# EAGLE design ProtoBricks_8x8 (EAGLE 9.6.2)
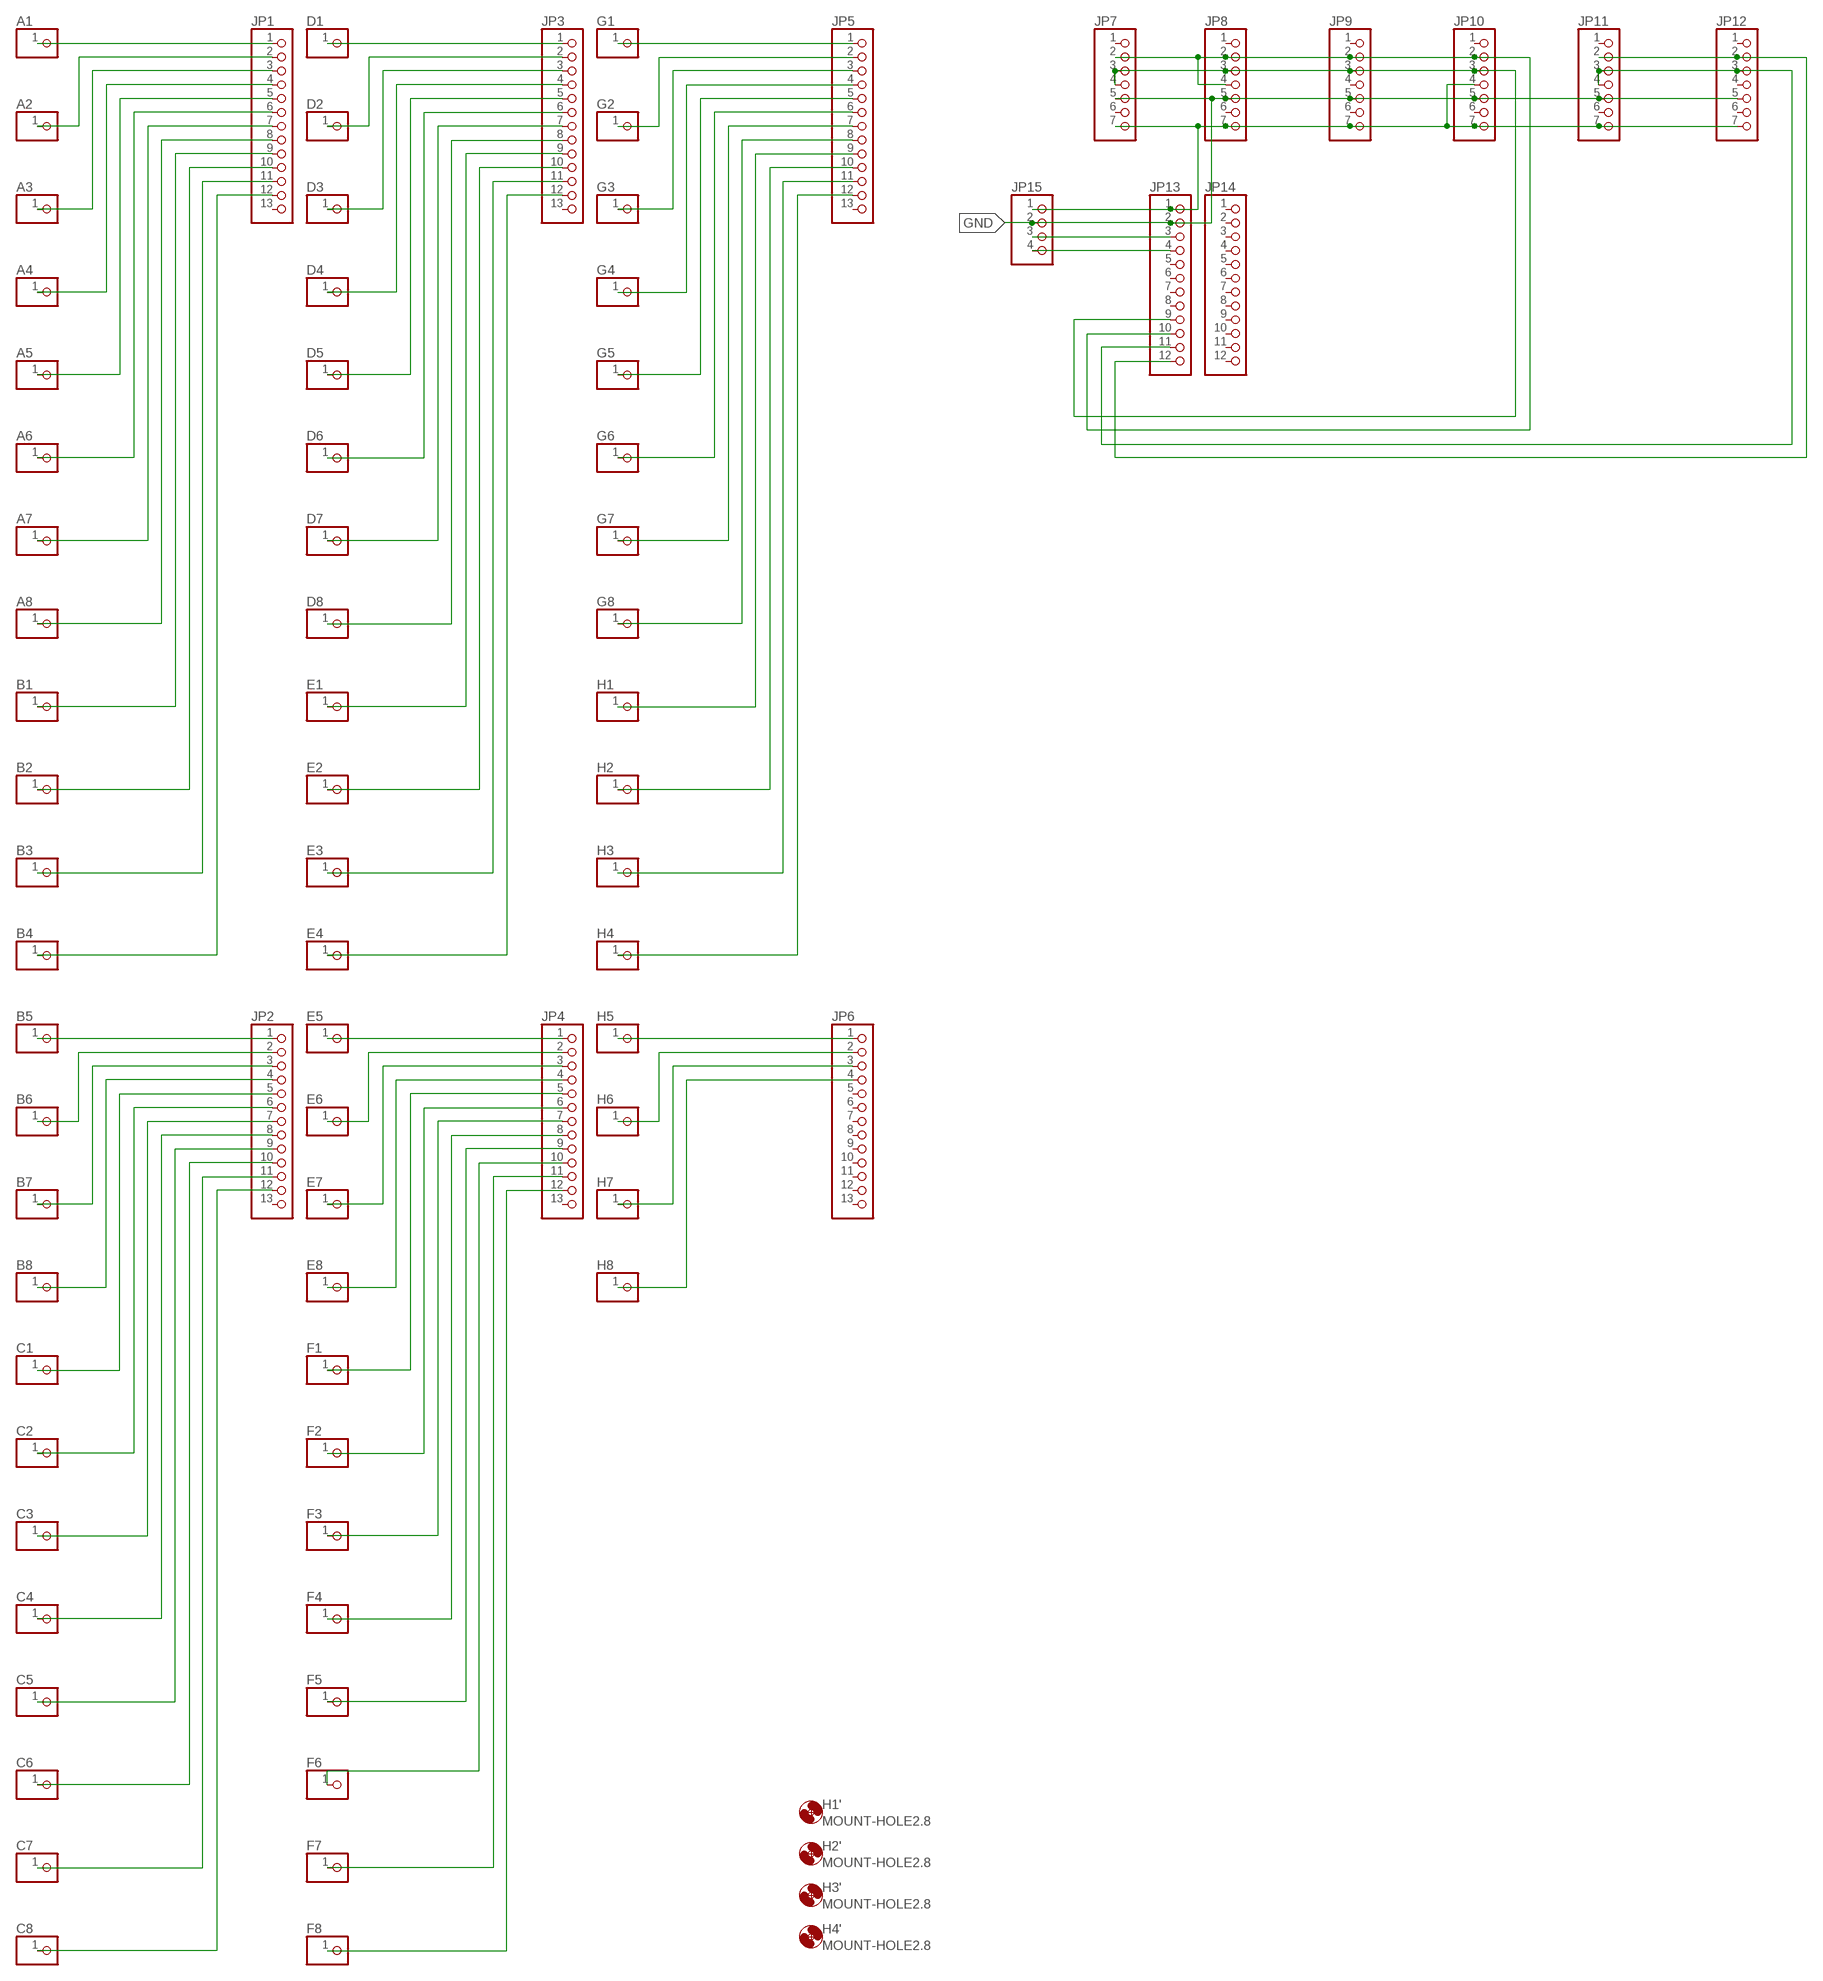
[diagram p0: schematic, sheet 1]

## Parts
A1  PINHD-1X1  [1X01]
A2  PINHD-1X1  [1X01]
A3  PINHD-1X1  [1X01]
A4  PINHD-1X1  [1X01]
A5  PINHD-1X1  [1X01]
A6  PINHD-1X1  [1X01]
A7  PINHD-1X1  [1X01]
A8  PINHD-1X1  [1X01]
B1  PINHD-1X1  [1X01]
B2  PINHD-1X1  [1X01]
B3  PINHD-1X1  [1X01]
B4  PINHD-1X1  [1X01]
B5  PINHD-1X1  [1X01]
B6  PINHD-1X1  [1X01]
B7  PINHD-1X1  [1X01]
B8  PINHD-1X1  [1X01]
C1  PINHD-1X1  [1X01]
C2  PINHD-1X1  [1X01]
C3  PINHD-1X1  [1X01]
C4  PINHD-1X1  [1X01]
C5  PINHD-1X1  [1X01]
C6  PINHD-1X1  [1X01]
C7  PINHD-1X1  [1X01]
C8  PINHD-1X1  [1X01]
D1  PINHD-1X1  [1X01]
D2  PINHD-1X1  [1X01]
D3  PINHD-1X1  [1X01]
D4  PINHD-1X1  [1X01]
D5  PINHD-1X1  [1X01]
D6  PINHD-1X1  [1X01]
D7  PINHD-1X1  [1X01]
D8  PINHD-1X1  [1X01]
E1  PINHD-1X1  [1X01]
E2  PINHD-1X1  [1X01]
E3  PINHD-1X1  [1X01]
E4  PINHD-1X1  [1X01]
E5  PINHD-1X1  [1X01]
E6  PINHD-1X1  [1X01]
E7  PINHD-1X1  [1X01]
E8  PINHD-1X1  [1X01]
F1  PINHD-1X1  [1X01]
F2  PINHD-1X1  [1X01]
F3  PINHD-1X1  [1X01]
F4  PINHD-1X1  [1X01]
F5  PINHD-1X1  [1X01]
F6  PINHD-1X1  [1X01]
F7  PINHD-1X1  [1X01]
F8  PINHD-1X1  [1X01]
G1  PINHD-1X1  [1X01]
G2  PINHD-1X1  [1X01]
G3  PINHD-1X1  [1X01]
G4  PINHD-1X1  [1X01]
G5  PINHD-1X1  [1X01]
G6  PINHD-1X1  [1X01]
G7  PINHD-1X1  [1X01]
G8  PINHD-1X1  [1X01]
H1  PINHD-1X1  [1X01]
H1'  MOUNT-HOLE2.8  [2,8]
H2  PINHD-1X1  [1X01]
H2'  MOUNT-HOLE2.8  [2,8]
H3  PINHD-1X1  [1X01]
H3'  MOUNT-HOLE2.8  [2,8]
H4  PINHD-1X1  [1X01]
H4'  MOUNT-HOLE2.8  [2,8]
H5  PINHD-1X1  [1X01]
H6  PINHD-1X1  [1X01]
H7  PINHD-1X1  [1X01]
H8  PINHD-1X1  [1X01]
JP1  PINHD-1X13  [1X13]
JP2  PINHD-1X13  [1X13]
JP3  PINHD-1X13  [1X13]
JP4  PINHD-1X13  [1X13]
JP5  PINHD-1X13  [1X13]
JP6  PINHD-1X13  [1X13]
JP7  PINHD-1X7  [1X07]
JP8  PINHD-1X7  [1X07]
JP9  PINHD-1X7  [1X07]
JP10  PINHD-1X7  [1X07]
JP11  PINHD-1X7  [1X07]
JP12  PINHD-1X7  [1X07]
JP13  PINHD-1X12  [1X12]
JP14  PINHD-1X12  [1X12]
JP15  PINHD-1X4  [1X04]

## Nets
GND: JP7.5 JP8.5 JP9.5 JP10.5 JP11.5 JP12.5 JP13.2 JP15.2
N$1: A1.1 JP1.1
N$2: A2.1 JP1.2
N$3: B5.1 JP2.1
N$4: A3.1 JP1.3
N$5: A4.1 JP1.4
N$6: A5.1 JP1.5
N$7: A6.1 JP1.6
N$8: A7.1 JP1.7
N$9: A8.1 JP1.8
N$10: B1.1 JP1.9
N$11: C8.1 JP2.12
N$12: C7.1 JP2.11
N$13: C6.1 JP2.10
N$14: C5.1 JP2.9
N$15: C4.1 JP2.8
N$16: B2.1 JP1.10
N$17: C3.1 JP2.7
N$18: C2.1 JP2.6
N$19: C1.1 JP2.5
N$20: B8.1 JP2.4
N$21: D1.1 JP3.1
N$22: B7.1 JP2.3
N$23: B6.1 JP2.2
N$24: D2.1 JP3.2
N$25: B3.1 JP1.11
N$26: D3.1 JP3.3
N$27: D4.1 JP3.4
N$28: D5.1 JP3.5
N$29: D6.1 JP3.6
N$30: D7.1 JP3.7
N$31: D8.1 JP3.8
N$32: B4.1 JP1.12
N$33: E1.1 JP3.9
N$34: E2.1 JP3.10
N$35: E3.1 JP3.11
N$36: E4.1 JP3.12
N$37: E5.1 JP4.1
N$38: E6.1 JP4.2
N$39: E7.1 JP4.3
N$40: E8.1 JP4.4
N$41: G1.1 JP5.1
N$42: G2.1 JP5.2
N$43: G3.1 JP5.3
N$44: G4.1 JP5.4
N$45: G5.1 JP5.5
N$46: G6.1 JP5.6
N$47: G7.1 JP5.7
N$48: G8.1 JP5.8
N$49: H1.1 JP5.9
N$50: H2.1 JP5.10
N$51: H3.1 JP5.11
N$52: H4.1 JP5.12
N$53: H5.1 JP6.1
N$54: H6.1 JP6.2
N$55: H7.1 JP6.3
N$56: H8.1 JP6.4
N$57: F1.1 JP4.5
N$58: F2.1 JP4.6
N$59: F3.1 JP4.7
N$60: F4.1 JP4.8
N$61: F5.1 JP4.9
N$62: F6.1 JP4.10
N$63: F7.1 JP4.11
N$64: F8.1 JP4.12
N$67: JP7.2 JP8.2 JP8.4 JP9.2 JP10.2 JP13.10
N$68: JP7.3 JP7.4 JP8.3 JP9.3 JP10.3 JP13.9
N$69: JP11.2 JP12.2 JP13.12
N$70: JP11.3 JP11.4 JP12.3 JP13.11
N$71: JP7.7 JP8.7 JP9.7 JP10.4 JP10.7 JP11.7 JP12.7 JP13.1 JP15.1
N$73: JP13.3 JP15.3
N$74: JP13.4 JP15.4
Unconnected: JP1.13 JP2.13 JP3.13 JP4.13 JP5.13 JP6.5 JP6.6 JP6.7 JP6.8 JP6.9 JP6.10 JP6.11 JP6.12 JP6.13 JP7.1 JP7.6 JP8.1 JP8.6 JP9.1 JP9.4 JP9.6 JP10.1 JP10.6 JP11.1 JP11.6 JP12.1 JP12.4 JP12.6 JP13.5 JP13.6 JP13.7 JP13.8 JP14.1 JP14.2 JP14.3 JP14.4 JP14.5 JP14.6 JP14.7 JP14.8 JP14.9 JP14.10 JP14.11 JP14.12

## Library data of the parts
A1-A8 B1-B8 C1-C8 D1-D8 E1-E8 F1-F8 G1-G8 H1-H8 = pinhead:PINHD-1X1: PIN HEADER
H1' H2' H3' H4' = holes:MOUNT-HOLE: MOUNTING HOLE with drill center marker
JP1-JP6 = pinhead:PINHD-1X13: PIN HEADER
JP7-JP12 = pinhead:PINHD-1X7: PIN HEADER
JP13 JP14 = pinhead:PINHD-1X12: PIN HEADER
JP15 = pinhead:PINHD-1X4: PIN HEADER

## Board
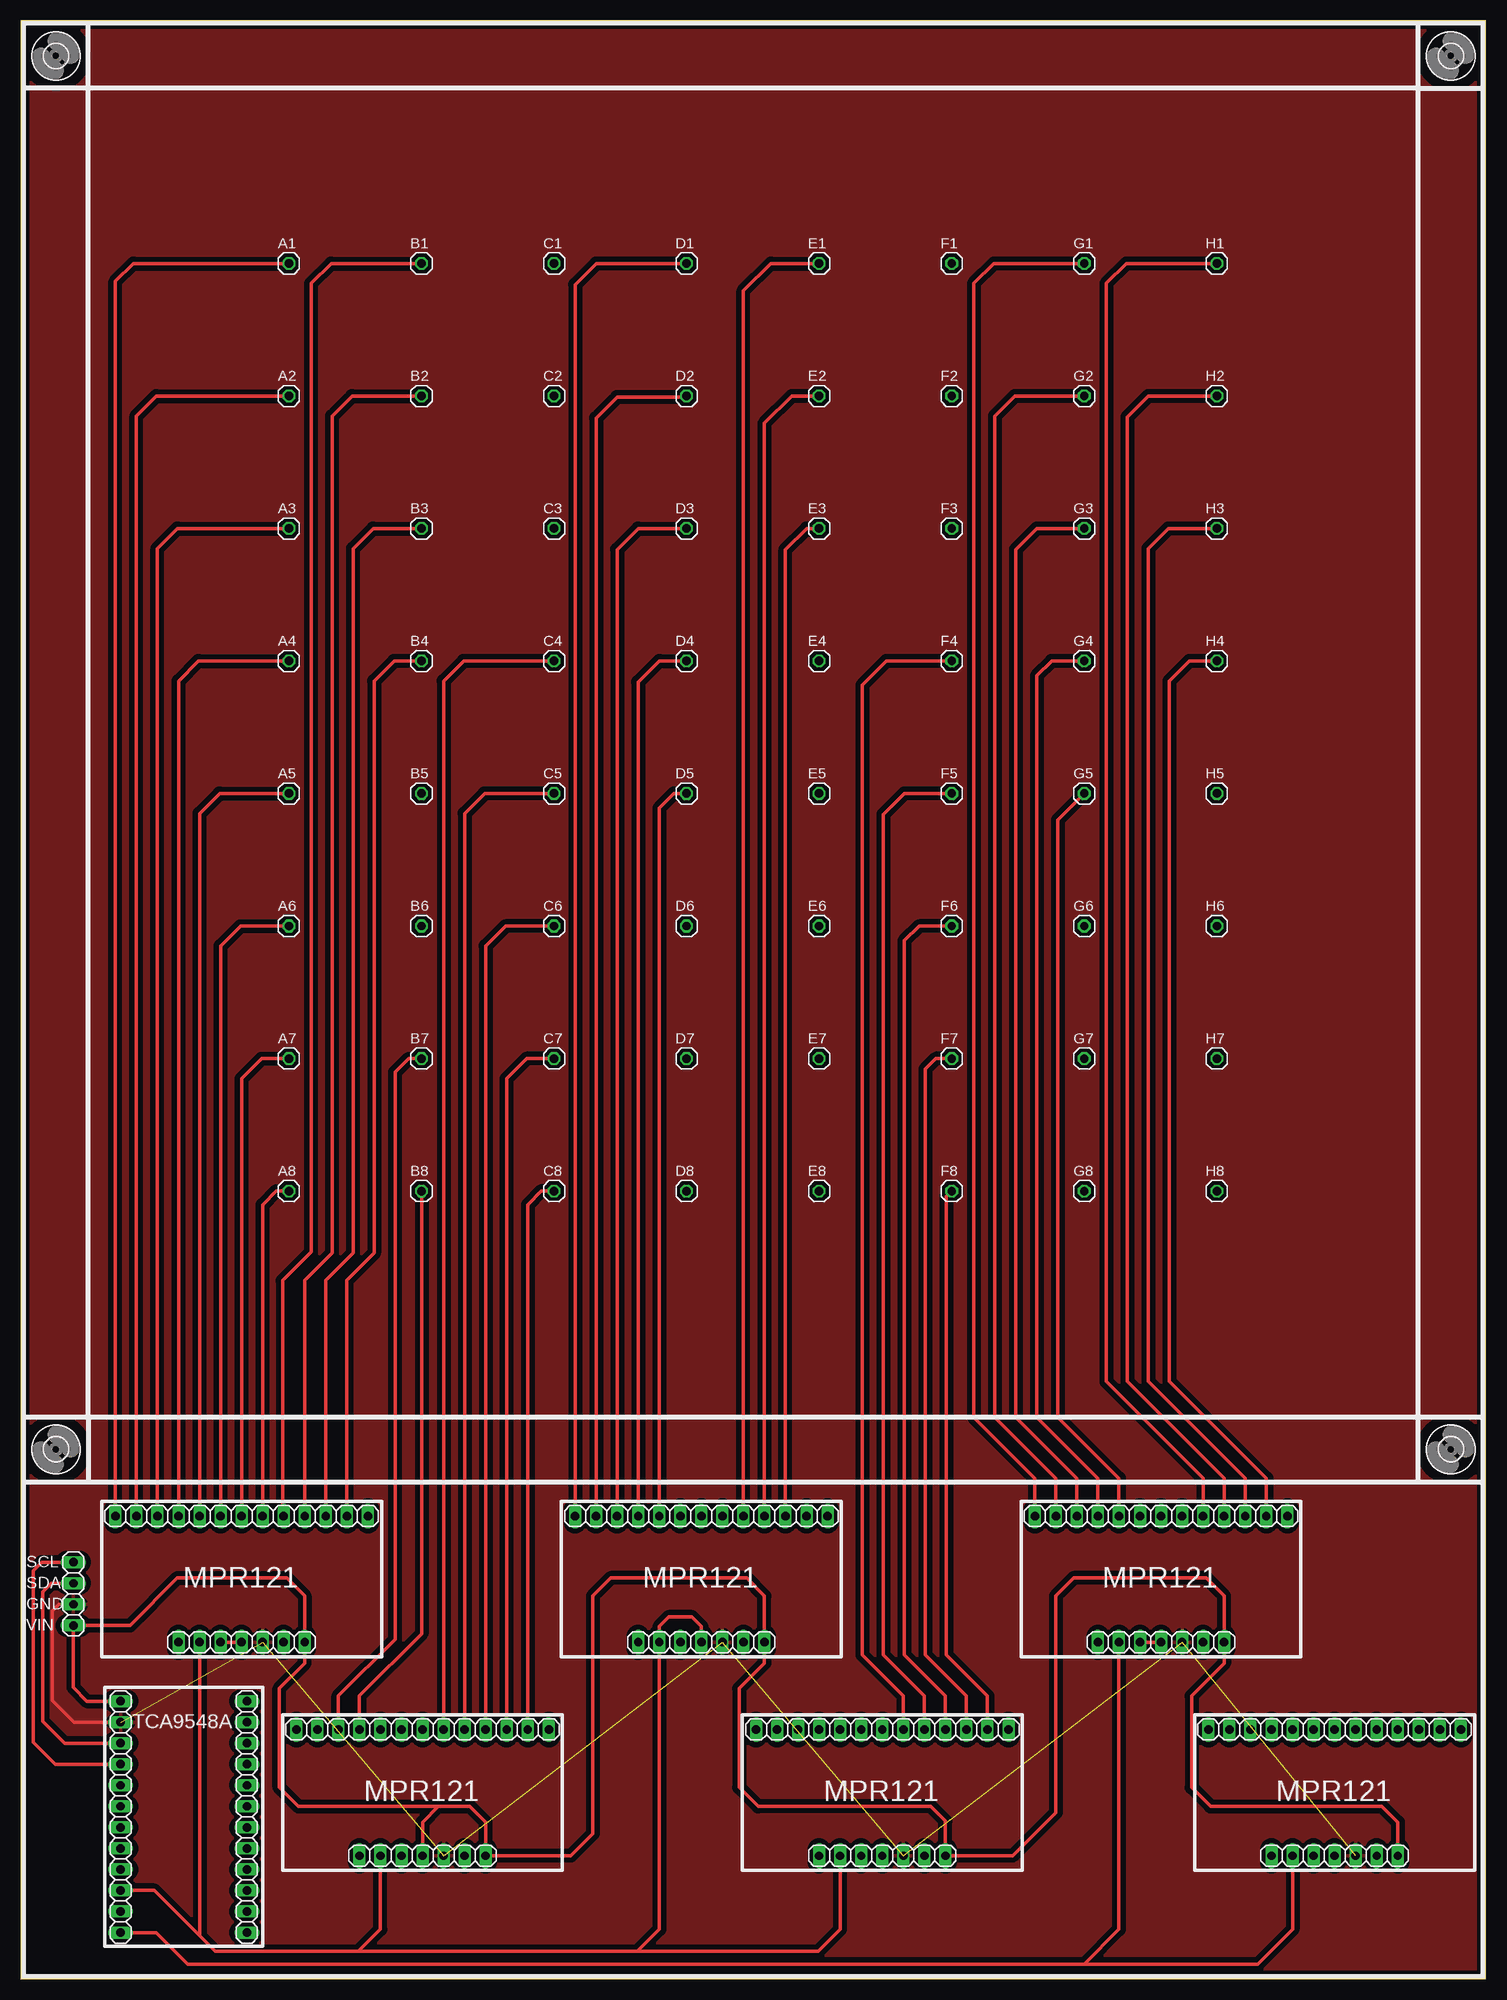
[diagram p1: board, top side]
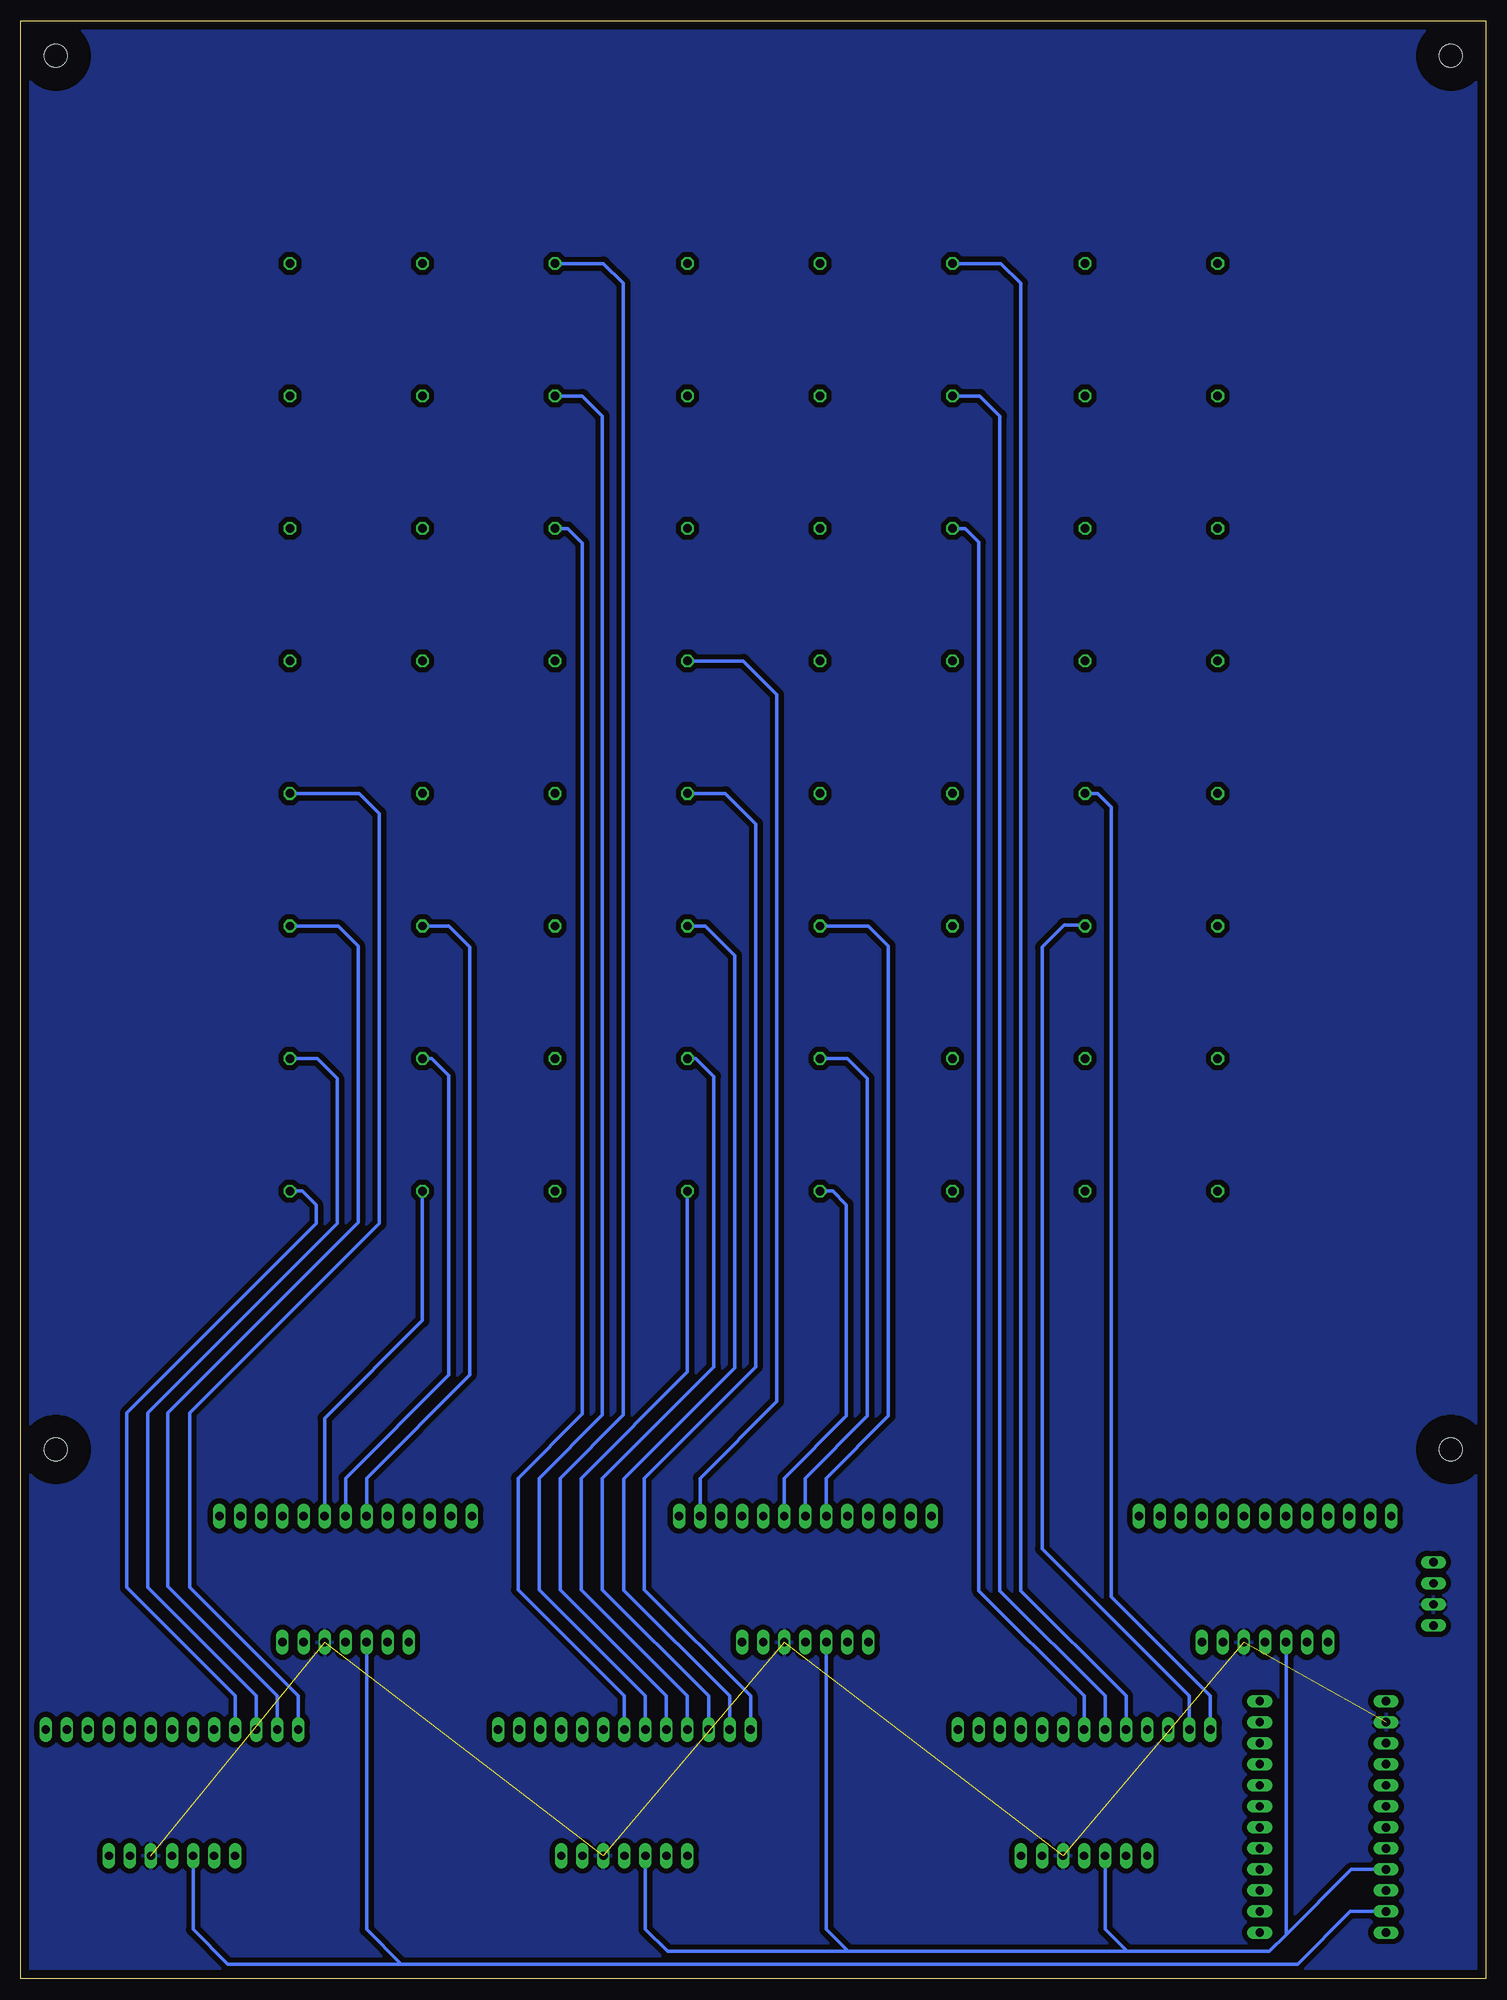
[diagram p2: board, bottom side, seen from below]

Size 176.89 x 236.45 mm. Coordinates in mm from the lower left corner, seen from the top.
Outline: 0,0 176.89,0 176.89,236.45 0,236.45 0,0
Copper layers (1*16): Top 0.035mm / dielectric 1.5mm / Bottom 0.035mm
Design rules "default": minimum track width 6mil, minimum drill 0.35mm, track to track 6mil, track to pad 6mil, pad to pad 6mil, via to via 6mil, smd to smd 6mil, copper to edge 40mil, drill to drill 6mil, minimum pad ring 10mil, minimum via ring 8mil, stop-mask expansion 4mil, vias tented up to drill 0mil, thermal gap 10mil

### Footprints (pad centres in the part's own frame; a part is rotated, then mirrored left to right if it is on the bottom)
1X01 = drill 1.016 octagon: 1 0,0
2,8 = hole 2.8: 0,0
1X13 = drill 1.016 long: 1 -15.24,0; 2 -12.7,0; 3 -10.16,0; 4 -7.62,0; 5 -5.08,0; 6 -2.54,0; 7 0,0; 8 2.54,0; 9 5.08,0; 10 7.62,0; 11 10.16,0; 12 12.7,0; 13 15.24,0
1X07 = drill 1.016 long: 1 -7.62,0; 2 -5.08,0; 3 -2.54,0; 4 0,0; 5 2.54,0; 6 5.08,0; 7 7.62,0
1X12 = drill 1.016 long: 1 -13.97,0; 2 -11.43,0; 3 -8.89,0; 4 -6.35,0; 5 -3.81,0; 6 -1.27,0; 7 1.27,0; 8 3.81,0; 9 6.35,0; 10 8.89,0; 11 11.43,0; 12 13.97,0
1X04 = drill 1.016 long: 1 -3.81,0; 2 -1.27,0; 3 1.27,0; 4 3.81,0

### Placement (x,y rotation side)
A1  32.38,207.14 0 top
A2  32.38,191.13 0 top
A3  32.38,175.13 0 top
A4  32.38,159.13 0 top
A5  32.38,143.13 0 top
A6  32.38,127.13 0 top
A7  32.38,111.12 0 top
A8  32.38,95.12 0 top
B1  48.39,207.14 0 top
B2  48.39,191.13 0 top
B3  48.39,175.13 0 top
B4  48.39,159.13 0 top
B5  48.39,143.13 0 top
B6  48.39,127.13 0 top
B7  48.39,111.12 0 top
B8  48.39,95.12 0 top
C1  64.39,207.14 0 top
C2  64.39,191.13 0 top
C3  64.39,175.13 0 top
C4  64.39,159.13 0 top
C5  64.39,143.13 0 top
C6  64.39,127.13 0 top
C7  64.39,111.12 0 top
C8  64.39,95.12 0 top
D1  80.39,207.14 0 top
D2  80.39,191.13 0 top
D3  80.39,175.13 0 top
D4  80.39,159.13 0 top
D5  80.39,143.13 0 top
D6  80.39,127.13 0 top
D7  80.39,111.12 0 top
D8  80.39,95.12 0 top
E1  96.39,207.14 0 top
E2  96.39,191.13 0 top
E3  96.39,175.13 0 top
E4  96.39,159.13 0 top
E5  96.39,143.13 0 top
E6  96.39,127.13 0 top
E7  96.39,111.12 0 top
E8  96.39,95.12 0 top
F1  112.39,207.14 0 top
F2  112.39,191.13 0 top
F3  112.39,175.13 0 top
F4  112.39,159.13 0 top
F5  112.39,143.13 0 top
F6  112.39,127.13 0 top
F7  112.39,111.12 0 top
F8  112.39,95.12 0 top
G1  128.4,207.14 0 top
G2  128.4,191.13 0 top
G3  128.4,175.13 0 top
G4  128.4,159.13 0 top
G5  128.4,143.13 0 top
G6  128.4,127.13 0 top
G7  128.4,111.12 0 top
G8  128.4,95.12 0 top
H1  144.4,207.14 0 top
H1'  4.24,63.93 0 top
H2  144.4,191.13 0 top
H2'  172.64,63.93 0 top
H3  144.4,175.13 0 top
H3'  4.24,232.21 0 top
H4  144.4,159.13 0 top
H4'  172.64,232.21 0 top
H5  144.4,143.13 0 top
H6  144.4,127.13 0 top
H7  144.4,111.12 0 top
H8  144.4,95.12 0 top
JP1  26.67,55.88 0 top
JP2  48.51,30.1 0 top
JP3  82.17,55.88 0 top
JP4  104.01,30.1 0 top
JP5  137.67,55.88 0 top
JP6  158.62,30.1 0 top
JP7  26.67,40.64 0 top
JP8  82.17,40.64 0 top
JP9  104.01,14.86 0 top
JP10  48.51,14.86 0 top
JP11  137.67,40.64 0 top
JP12  158.62,14.86 0 top
JP13  12.06,19.56 270 top
JP14  27.3,19.56 270 top
JP15  6.35,46.48 90 top

### Tracks (layer width: path | path; a pad name or v marks a point on that pad's centre or on a via)
GND  (6 unrouted)
  Top 0.406: JP13.2 6.48,30.99 3.81,33.66 3.81,44.45 4.57,45.21 JP15.2
  pour Top (isolate 0.635): 0,236.47 0,-0.13 176.91,-0.13 176.91,236.47
  pour Bottom (isolate 0.635): 0,-0.13 176.91,-0.13 176.91,236.47 0,236.47
N$1
  Top 0.406: JP1.1 11.43,204.98 13.59,207.14 A1.1
N$2
  Top 0.406: JP1.2 13.97,188.72 16.38,191.13 A2.1
N$3
  Bottom 0.406: JP2.1 33.27,34.16 45.21,46.1 45.21,141.48 46.86,143.13 B5.1
N$4
  Top 0.406: JP1.3 16.51,172.72 18.92,175.13 A3.1
N$5
  Top 0.406: JP1.4 19.05,156.72 21.46,159.13 A4.1
N$6
  Top 0.406: JP1.5 21.59,140.72 24,143.13 A5.1
N$7
  Top 0.406: JP1.6 24.13,124.71 26.54,127.13 A6.1
N$8
  Top 0.406: JP1.7 26.67,108.71 29.08,111.12 A7.1
N$9
  Top 0.406: JP1.8 29.21,93.47 30.86,95.12 A8.1
N$10
  Top 0.406: JP1.9 31.62,56.01 31.62,84.33 35.05,87.76 35.05,204.72 37.47,207.14 B1.1
N$11
  Top 0.406: C8.1 62.87,95.12 61.21,93.47 JP2.12
N$12
  Top 0.406: C7.1 61.09,111.12 58.67,108.71 JP2.11
N$13
  Top 0.406: C6.1 58.55,127.13 56.13,124.71 JP2.10
N$14
  Top 0.406: C5.1 56.01,143.13 53.59,140.72 JP2.9
N$15
  Top 0.406: C4.1 53.47,159.13 51.05,156.72 JP2.8
N$16
  Top 0.406: JP1.10 34.29,84.33 37.59,87.63 37.59,188.72 40.01,191.13 B2.1
N$17
  Bottom 0.406: JP2.7 48.51,34.16 61.21,46.86 61.21,173.48 62.87,175.13 C3.1
N$18
  Bottom 0.406: JP2.6 45.97,34.16 58.67,46.86 58.67,188.72 61.09,191.13 C2.1
N$19
  Bottom 0.406: JP2.5 43.43,34.16 56.13,46.86 56.13,204.72 58.55,207.14 C1.1
N$20
  Top 0.406: JP2.4 40.89,34.16 48.39,41.66 B8.1
N$21
  Top 0.406: D1.1 69.47,207.14 66.93,204.6 66.93,59.69 JP3.1
N$22
  Top 0.406: JP2.3 38.35,34.16 45.21,41.02 45.21,109.47 46.86,111.12 B7.1
N$23
  Bottom 0.406: B6.1 48.51,127.25 50.93,127.25 53.59,124.59 53.59,51.94 35.81,34.16 JP2.2
N$24
  Top 0.406: D2.1 80.26,191.01 72.01,191.01 69.47,188.47 JP3.2
N$25
  Top 0.406: JP1.11 36.83,84.33 40.13,87.63 40.13,172.72 42.55,175.13 B3.1
N$26
  Top 0.406: JP3.3 72.01,172.59 74.55,175.13 D3.1
N$27
  Top 0.406: JP3.4 74.55,156.59 77.09,159.13 D4.1
N$28
  Top 0.406: D5.1 78.87,143.13 77.09,141.35 JP3.5
N$29
  Bottom 0.406: D6.1 74.55,127.13 72.14,124.71 72.14,67.94 79.63,60.45 JP3.6
N$30
  Bottom 0.406: D7.1 77.09,111.12 74.68,108.71 74.68,67.94 82.17,60.45 JP3.7
N$31
  Bottom 0.406: D8.1 78.87,95.12 77.22,93.47 77.22,67.94 84.71,60.45 JP3.8
N$32
  Top 0.406: JP1.12 39.37,84.33 42.67,87.63 42.67,156.72 45.09,159.13 B4.1
N$33
  Top 0.406: JP3.9 87.25,203.84 90.55,207.14 E1.1
N$34
  Top 0.406: E2.1 93.09,191.13 89.79,187.83 JP3.10
N$35
  Top 0.406: JP3.11 92.33,172.59 94.87,175.13 E3.1
N$36
  Bottom 0.406: E4.1 89.66,159.13 85.6,155.07 85.6,69.72 94.87,60.45 JP3.12
N$37
  Bottom 0.406: E5.1 91.82,143.13 88.14,139.45 88.14,73.91 101.6,60.45 101.6,46.99 88.77,34.16 JP4.1
N$38
  Bottom 0.406: E6.1 94.23,127.13 90.68,123.57 90.68,73.79 104.08,60.39 104.08,46.93 91.31,34.16 JP4.2
N$39
  Bottom 0.406: JP4.3 93.85,34.16 106.68,46.99 106.68,60.45 93.22,73.91 93.22,108.97 95.38,111.12 E7.1
N$40
  Bottom 0.406: E8.1 96.39,73.28 109.22,60.45 109.22,46.99 96.39,34.16 JP4.4
N$41
  Top 0.406: G1.1 117.47,207.14 115.06,204.72 115.06,67.82 122.43,60.45 JP5.1
N$42
  Top 0.406: G2.1 120.02,191.13 117.6,188.72 117.6,67.82 124.97,60.45 JP5.2
N$43
  Top 0.406: G3.1 122.68,175.13 120.14,172.59 120.14,67.82 127.51,60.45 JP5.3
N$44
  Top 0.406: G4.1 124.46,159.13 122.68,157.35 122.68,67.82 130.05,60.45 JP5.4
N$45
  Top 0.406: G5.1 125.22,139.95 125.22,67.82 132.59,60.45 JP5.5
N$46
  Bottom 0.406: G6.1 125.22,127.13 122.68,124.59 122.68,72.9 135.13,60.45 JP5.6
N$47
  Bottom 0.406: G7.1 127.25,111.12 125.22,109.09 125.22,72.9 137.67,60.45 JP5.7
N$48
  Bottom 0.406: G8.1 128.4,79.5 140.21,67.69 JP5.8
N$49
  Top 0.406: H1.1 133.48,207.14 131.06,204.72 131.06,72.14 142.75,60.45 JP5.9
N$50
  Top 0.406: H2.1 136.14,191.13 133.6,188.59 133.6,72.14 145.29,60.45 JP5.10
N$51
  Top 0.406: H3.1 138.56,175.13 136.14,172.72 136.14,72.14 147.83,60.45 JP5.11
N$52
  Top 0.406: H4.1 141.1,159.13 138.68,156.72 138.68,72.14 150.37,60.45 JP5.12
N$53
  Bottom 0.406: H5.1 136.02,143.13 133.6,140.72 133.6,91.19 156.46,68.33 156.46,47.24 143.38,34.16 JP6.1
N$54
  Bottom 0.406: H6.1 138.56,127.13 136.14,124.71 136.14,91.31 159.13,68.33 159.13,47.37 145.92,34.16 JP6.2
N$55
  Bottom 0.406: H7.1 141.1,111.12 138.68,108.71 138.68,91.19 161.54,68.33 161.54,47.24 148.46,34.16 JP6.3
N$56
  Bottom 0.406: H8.1 142.88,95.12 141.22,93.47 141.22,91.19 164.08,68.33 164.08,47.24 151,34.16 JP6.4
N$57
  Bottom 0.406: F1.1 106.55,207.14 104.14,204.72 104.14,68.07 111.76,60.45 111.76,46.99 98.93,34.16 JP4.5
N$58
  Bottom 0.406: F2.1 109.09,191.13 106.68,188.72 106.68,68.07 114.3,60.45 114.3,46.99 101.47,34.16 JP4.6
N$59
  Bottom 0.406: F3.1 110.87,175.13 109.09,173.36 109.09,68.2 116.84,60.45 116.84,46.99 104.01,34.16 JP4.7
N$60
  Top 0.406: F4.1 104.52,159.13 101.6,156.21 101.6,39.12 106.55,34.16 JP4.8
N$61
  Top 0.406: F5.1 106.68,143.13 104.14,140.59 104.14,39.12 109.09,34.16 JP4.9
N$62
  Top 0.406: F6.1 108.46,127.13 106.68,125.35 106.68,39.12 111.63,34.16 JP4.10
N$63
  Top 0.406: F7.1 110.49,111.12 109.22,109.85 109.22,39.12 114.17,34.16 JP4.11
N$64
  Top 0.406: JP4.12 116.71,34.16 111.76,39.12 111.76,94.49 F8.1
N$67
  Top 0.406: JP7.2 21.59,5.21 | 21.59,5.21 23.5,3.3 40.77,3.3 | 40.77,3.3 43.43,5.97 JP10.2 | 40.77,3.3 74.42,3.3 | 74.42,3.3 96.27,3.3 98.93,5.97 JP9.2 | 74.42,3.3 77.09,5.97 JP8.2 77.09,42.55 78.23,43.69 81.03,43.69 82.17,42.55 JP8.4 | JP13.10 16.13,10.67 21.59,5.21
N$68
  Top 0.406: JP7.4 JP7.3
  Bottom 0.406: JP10.3 45.97,5.97 43.31,3.3 | 43.31,3.3 26.16,3.3 24.13,5.33 | JP7.3 24.13,5.33 | JP9.3 101.47,5.97 98.81,3.3 76.96,3.3 | 76.96,3.3 43.31,3.3 | JP8.3 79.63,5.97 76.96,3.3 | 24.13,5.33 16.26,13.21 JP13.9
N$69
  Top 0.406: JP12.2 153.54,5.97 149.35,1.78 128.4,1.78 | JP13.12 16.38,5.59 20.19,1.78 128.4,1.78 | JP11.2 132.59,5.97 128.4,1.78
N$70
  Top 0.406: JP11.4 JP11.3
  Bottom 0.406: JP11.3 135.13,5.97 130.94,1.78 | 130.94,1.78 22.73,1.78 16.38,8.13 JP13.11 | JP12.3 156.08,5.97 151.89,1.78 130.94,1.78
N$71
  Top 0.406: JP13.1 8,33.53 6.35,35.18 JP15.1 13.21,42.67 18.92,48.39 32.13,48.39 34.29,46.23 JP7.7 34.29,38.1 31.24,35.05 31.24,23.11 33.53,20.83 50.42,20.83 | 50.42,20.83 54.23,20.83 56.13,18.92 JP10.7 66.42,14.86 69.09,17.53 69.09,46.23 71.25,48.39 87.63,48.39 89.79,46.23 JP8.7 89.79,38.1 86.74,35.05 86.74,23.11 89.03,20.83 109.86,20.83 111.63,19.05 JP9.7 119.76,14.86 124.97,20.07 124.97,46.23 127.13,48.39 143.13,48.39 145.29,46.23 JP11.7 145.29,38.1 141.35,34.16 141.35,23.11 143.64,20.83 164.34,20.83 166.24,18.92 JP12.7 | JP10.4 48.51,18.92 50.42,20.83
N$73
  Top 0.406: JP13.3 5.33,28.45 2.67,31.11 2.67,46.74 3.68,47.75 JP15.3
N$74
  Top 0.406: JP15.4 2.54,50.29 1.52,49.28 1.52,28.57 4.19,25.91 JP13.4

### Text on the board
tPlace: SCL | MPR121 | MPR121 | MPR121 | SDA | GND | VIN | TCA9548A | MPR121 | MPR121 | MPR121